# EAGLE design main (EAGLE 6.5.0)
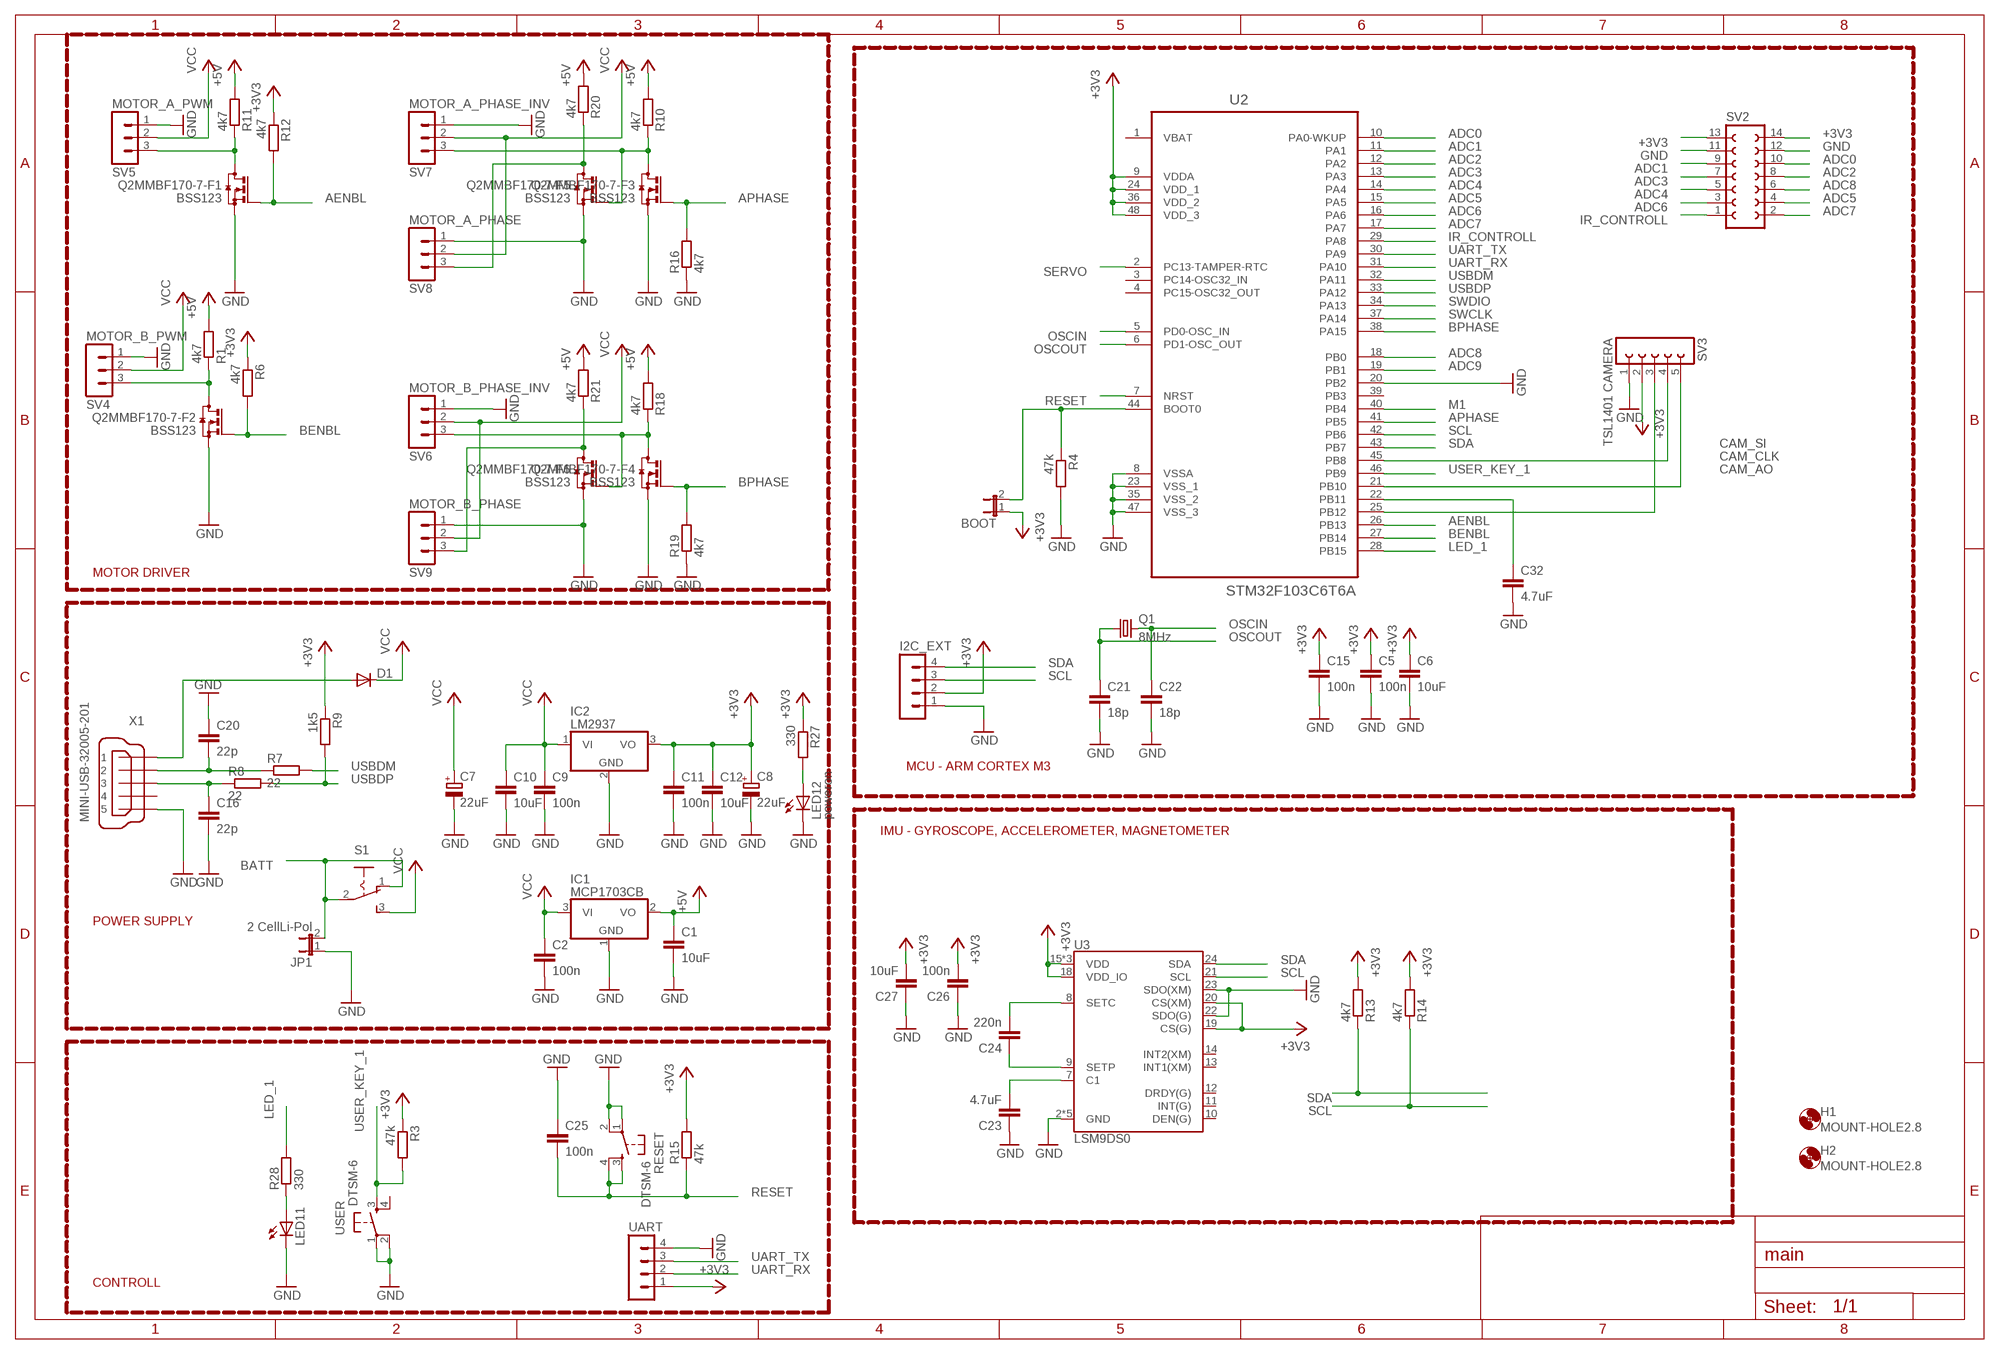
[diagram p0: schematic, sheet 1]

## Parts
BOOT  JP1E  [JP1]
C1  10uF  C-EUC0805  [C0805]
C2  100n  C-EUC0805  [C0805]
C5  100n  C-EUC0805  [C0805]
C6  10uF  C-EUC0805  [C0805]
C7  22uF  CPOL-EU153CLV-0505  [153CLV-0505]
C8  22uF  CPOL-EU153CLV-0505  [153CLV-0505]
C9  100n  C-EUC0805  [C0805]
C10  10uF  C-EUC0805  [C0805]
C11  100n  C-EUC0805  [C0805]
C12  10uF  C-EUC0805  [C0805]
C15  100n  C-EUC0805  [C0805]
C16  22p  C-EUC0805  [C0805]
C20  22p  C-EUC0805  [C0805]
C21  18p  C-EUC0805  [C0805]
C22  18p  C-EUC0805  [C0805]
C23  4.7uF  C-EUC0805  [C0805]
C24  220n  C-EUC0805  [C0805]
C25  100n  C-EUC0805  [C0805]
C26  100n  C-EUC0805  [C0805]
C27  10uF  C-EUC0805  [C0805]
C32  4.7uF  C-EUC0805  [C0805]
D1  DIODE-SMB  [SMB]
H1  MOUNT-HOLE2.8  [2,8]
H2  MOUNT-HOLE2.8  [2,8]
I2C_EXT  MA04-1  [MA04-1]
IC1  MCP1703CB  [SOT23]
IC2  LM2937  [TO263-3]
JP1  2 CellLi-Pol  JP1E  [JP1]
LED11  LEDCHIPLED_1206  [CHIPLED_1206]
LED12  poweron  LEDCHIPLED_1206  [CHIPLED_1206]
Q1  8MHz  CRYSTALCTS406  [CTS406]
Q2MMBF170-7-F1  BSS123  [SOT23]
Q2MMBF170-7-F2  BSS123  [SOT23]
Q2MMBF170-7-F3  BSS123  [SOT23]
Q2MMBF170-7-F4  BSS123  [SOT23]
Q2MMBF170-7-F5  BSS123  [SOT23]
Q2MMBF170-7-F6  BSS123  [SOT23]
R1  4k7  R-EU_M0805  [M0805]
R3  47k  R-EU_M0805  [M0805]
R4  47k  R-EU_M0805  [M0805]
R6  4k7  R-EU_M0805  [M0805]
R7  22  R-EU_M0805  [M0805]
R8  22  R-EU_M0805  [M0805]
R9  1k5  R-EU_M0805  [M0805]
R10  4k7  R-EU_M0805  [M0805]
R11  4k7  R-EU_M0805  [M0805]
R12  4k7  R-EU_M0805  [M0805]
R13  4k7  R-EU_M0805  [M0805]
R14  4k7  R-EU_M0805  [M0805]
R15  47k  R-EU_M0805  [M0805]
R16  4k7  R-EU_M0805  [M0805]
R18  4k7  R-EU_M0805  [M0805]
R19  4k7  R-EU_M0805  [M0805]
R20  4k7  R-EU_M0805  [M0805]
R21  4k7  R-EU_M0805  [M0805]
R27  330  R-EU_M0805  [M0805]
R28  330  R-EU_M0805  [M0805]
RESET  DTSM-6  [DTSM-6]
S1  255SB  [255SB]
SV2  FE07-2  [FE07-2]
SV3  TSL1401 CAMERA  FE05-1  [FE05-1]
SV4  MOTOR_B_PWM  MA03-1  [MA03-1]
SV5  MOTOR_A_PWM  MA03-1  [MA03-1]
SV6  MOTOR_B_PHASE_INV  MA03-1  [MA03-1]
SV7  MOTOR_A_PHASE_INV  MA03-1  [MA03-1]
SV8  MOTOR_A_PHASE  MA03-1  [MA03-1]
SV9  MOTOR_B_PHASE  MA03-1  [MA03-1]
U2  STM32F103C6T6A  [QFP50P900X900X160-48N]
U3  LSM9DS0  [LGA-24]
UART  MA04-1  [MA04-1]
USER  DTSM-6  [DTSM-6]
X1  MINI-USB-32005-201  [32005-201]

## Nets
+3V3: BOOT.1 C5.1 C6.1 C8.+ C11.1 C12.1 C15.1 C26.2 C27.2 I2C_EXT.2 IC2.3(VO) R3.1 R6.1 R9.1 R12.1 R13.2 R14.2 R15.2 R27.1 SV2.13 SV2.14 SV3.2 U2.9(VDDA) U2.24(VDD_1) U2.36(VDD_2) U2.48(VDD_3) U3.15(VDD) U3.16(VDD) U3.17(VDD) U3.18(VDD_IO) U3.19(CS(G)) U3.20(CS(XM)) UART.1
+5V: C1.1 IC1.2(VO) R1.2 R10.2 R11.2 R18.2 R20.2 R21.2
ADC0: SV2.10 U2.10(PA0-WKUP)
ADC1: SV2.9 U2.11(PA1)
ADC2: SV2.8 U2.12(PA2)
ADC3: SV2.7 U2.13(PA3)
ADC4: SV2.5 U2.14(PA4)
ADC5: SV2.4 U2.15(PA5)
ADC6: SV2.3 U2.16(PA6)
ADC7: SV2.2 U2.17(PA7)
ADC8: SV2.6 U2.18(PB0)
ADC9: U2.19(PB1)
AENBL: Q2MMBF170-7-F1.1(G) R12.2 U2.26(PB13)
APHASE: Q2MMBF170-7-F3.1(G) R16.2 U2.41(PB5)
BATT: JP1.2 S1.1(O) S1.2(P)
BENBL: Q2MMBF170-7-F2.1(G) R6.2 U2.27(PB14)
BPHASE: Q2MMBF170-7-F4.1(G) R19.2 U2.38(PA15)
CAM_AO: SV3.3 U2.25(PB12)
CAM_CLK: SV3.4 U2.45(PB8)
CAM_SI: SV3.5 U2.21(PB10)
GND: C1.2 C2.2 C5.2 C6.2 C7.- C8.- C9.2 C10.2 C11.2 C12.2 C15.2 C16.2 C20.1 C21.2 C22.2 C23.1 C25.1 C26.1 C27.1 C32.2 I2C_EXT.1 IC1.1(GND) IC2.2(GND) JP1.1 LED11.C LED12.C Q2MMBF170-7-F1.2(S) Q2MMBF170-7-F2.2(S) Q2MMBF170-7-F3.2(S) Q2MMBF170-7-F4.2(S) Q2MMBF170-7-F5.2(S) Q2MMBF170-7-F6.2(S) R4.2 R16.1 R19.1 RESET.1 RESET.2 SV2.11 SV2.12 SV3.1 SV4.1 SV5.1 SV6.1 SV7.1 SV8.1 SV9.1 U2.8(VSSA) U2.20(PB2) U2.23(VSS_1) U2.35(VSS_2) U2.47(VSS_3) U3.2(GND) U3.3(GND) U3.4(GND) U3.5(GND) U3.6(GND) U3.22(SDO(G)) U3.23(SDO(XM)) UART.4 USER.1 USER.2 X1.5
IR_CONTROLL: SV2.1 U2.29(PA8)
LED_1: R28.2 U2.28(PB15)
M1: U2.40(PB4)
N$1: Q2MMBF170-7-F5.3(D) R20.1 SV8.3
N$2: Q2MMBF170-7-F4.3(D) Q2MMBF170-7-F6.1(G) R18.1 SV6.3
N$3: Q2MMBF170-7-F1.3(D) R11.1 SV5.3
N$4: Q2MMBF170-7-F2.3(D) R1.1 SV4.3
N$5: Q2MMBF170-7-F3.3(D) Q2MMBF170-7-F5.1(G) R10.1 SV7.3
N$6: C23.2 U3.7(C1)
N$7: C24.2 U3.8(SETC)
N$8: Q2MMBF170-7-F6.3(D) R21.1 SV9.3
N$13: C24.1 U3.9(SETP)
N$14: C32.1 U2.22(PB11)
N$16: BOOT.2 R4.1 U2.44(BOOT0)
N$23: LED12.A R27.2
N$33: LED11.A R28.1
N$55: C20.2 R7.1 X1.2
N$56: C16.1 R8.1 X1.3
N$57: D1.A X1.1
OSCIN: C22.1 Q1.3 U2.5(PD0-OSC_IN)
OSCOUT: C21.1 Q1.1 U2.6(PD1-OSC_OUT)
RESET: C25.2 R15.1 RESET.3 RESET.4 U2.7(NRST)
SCL: I2C_EXT.3 R14.1 U2.42(PB6) U3.21(SCL)
SDA: I2C_EXT.4 R13.1 U2.43(PB7) U3.24(SDA)
SERVO: U2.2(PC13-TAMPER-RTC)
SWCLK: U2.37(PA14)
SWDIO: U2.34(PA13)
UART_RX: U2.31(PA10) UART.2
UART_TX: U2.30(PA9) UART.3
USBDM: R7.2 U2.32(PA11)
USBDP: R8.2 R9.2 U2.33(PA12)
USER_KEY_1: R3.2 U2.46(PB9) USER.3
VCC: C2.1 C7.+ C9.1 C10.1 D1.C IC1.3(VI) IC2.1(VI) S1.3(S) SV4.2 SV5.2 SV6.2 SV7.2 SV8.2 SV9.2
Unconnected: U2.3(PC14-OSC32_IN) U2.4(PC15-OSC32_OUT) U2.39(PB3) U3.10(DEN(G)) U3.11(INT(G)) U3.12(DRDY(G)) U3.13(INT1(XM)) U3.14(INT2(XM)) USER.4 X1.4

## Notes on the sheet
- MOTOR DRIVER
- MCU - ARM CORTEX M3
- IMU - GYROSCOPE, ACCELEROMETER, MAGNETOMETER
- POWER SUPPLY
- CONTROLL

## Power pins joined to a net without a drawn wire
VBAT: U2.1(VBAT)

## Library data of the parts
BOOT JP1 = jumper:JP1E: JUMPER
C1 C2 C5 C6 C9-C12 C15 C16 C20-C27 C32 = resistor:C-EU: CAPACITOR, European symbol
C7 C8 = resistor:CPOL-EU: POLARIZED CAPACITOR, European symbol
D1 = diode:DIODE-: DIODE
H1 H2 = holes:MOUNT-HOLE: MOUNTING HOLE with drill center marker
I2C_EXT UART = con-lstb:MA04-1: PIN HEADER; OC_FARNELL: unknown; OC_NEWARK: unknown
IC1 = linear:MCP1703: 250 mA, 16V, Low Quiescent Current LDO Regulator Source: http://ww1.microchip.com/downloads/en/DeviceDoc/22049b.pdf
IC2 = linear:LM2937: LM2937-2.5, LM2937-3.3 400mA and 500mA Voltage Regulators Source: http://cache.national.com/ds/LM/LM2937-2.5.pdf
LED11 LED12 = led:LED: LED OSRAM: - CHIPLED LG R971, LG N971, LY N971, LG Q971, LY Q971, LO R971, LY R971 LH N974, LH R974 LS Q976, LO Q976, LY Q976 LO Q996 - Hyper CHIPLED LW Q18S LB Q993, LB Q99A, LB R99A - SideLED LS A670, LO A670, LY A670, LG A670, LP A670 LB A673, LV A673, LT A673, LW A673 LH A674 LY A675 LS A676, LA A676, LO A676, LY A676, LW A676 LS A679, LY A679, LG A679 - Hyper Micro SIDELED® LS Y876, LA Y876, LO Y876, LY Y876 LT Y87S - SmartLED LW L88C, LW L88S LB L89C, LB L89S, LG L890 LS L89K, LO L89K, LY L89K LS L896, LA L896, LO L896, LY L896 - TOPLED LS T670, LO T670, LY T670, LG T670, LP T670 LSG T670, LSP T670, LSY T670, LOP T670, LYG T670 LG T671, LOG T671, LSG T671 LB T673, LV T673, LT T673, LW T673 LH T674 LS T676, LA T676, LO T676, LY T676, LB T676, LH T676, LSB T676, LW T676 LB T67C, LV T67C, LT T67C, LS T67K, LO T67K, LY T67K, LW E67C LS E67B, LA E67B, LO E67B, LY E67B, LB E67C, LV E67C, LT E67C LW T67C LS T679, LY T679, LG T679 LS T770, LO T770, LY T770, LG T770, LP T770 LB T773, LV T773, LT T773, LW T773 LH T774 LS E675, LA E675, LY E675, LS T675 LS T776, LA T776, LO T776, LY T776, LB T776 LHGB T686 LT T68C, LB T68C - Hyper Mini TOPLED® LB M676 - Mini TOPLED Santana® LG M470 LS M47K, LO M47K, LY M47K Source: http://www.osram.convergy.de LUXEON: - LUMILED® LXK2-PW12-R00, LXK2-PW12-S00, LXK2-PW14-U00, LXK2-PW14-V00 LXK2-PM12-R00, LXK2-PM12-S00, LXK2-PM14-U00 LXK2-PE12-Q00, LXK2-PE12-R00, LXK2-PE12-S00, LXK2-PE14-T00, LXK2-PE14-U00 LXK2-PB12-K00, LXK2-PB12-L00, LXK2-PB12-M00, LXK2-PB14-N00, LXK2-PB14-P00, LXK2-PB14-Q00 LXK2-PR12-L00, LXK2-PR12-M00, LXK2-PR14-Q00, LXK2-PR14-R00 LXK2-PD12-Q00, LXK2-PD12-R00, LXK2-PD12-S00 LXK2-PH12-R00, LXK2-PH12-S00 LXK2-PL12-P00, LXK2-PL12-Q00, LXK2-PL12-R00 Source: www.luxeon.com KINGBRIGHT: KA-3528ASYC Source: www.kingbright.com
Q1 = crystal:CRYSTAL: CRYSTAL; OC_FARNELL: unknown; OC_NEWARK: unknown
Q2MMBF170-7-F1-Q2MMBF170-7-F6 = transistor-small-signal:BSS123: N-CHANNEL MOS FET
R1 R3 R4 R6-R16 R18-R21 R27 R28 = resistor:R-EU_: RESISTOR, European symbol
RESET USER = switch-tact:DTSM-6
S1 = switch:255SB: SLIDING SWITCH Distributor Buerklin, 11G810
SV2 = con-lsta:FE07-2: FEMALE HEADER; OC_FARNELL: unknown; OC_NEWARK: unknown
SV3 = con-lsta:FE05-1: FEMALE HEADER; OC_FARNELL: unknown; OC_NEWARK: unknown
SV4-SV9 = con-lstb:MA03-1: PIN HEADER; OC_FARNELL: unknown; OC_NEWARK: unknown
U2 = stm32f103_lqfp48:STM32F103C6T6A: MCU, 32BIT, 32K FLASH, 48LQFP; MPN: STM32F103C6T6A; OC_FARNELL: 1972391; OC_NEWARK: 72T2643; PACKAGE: 48LQFP; SUPPLIER: STMicroelectronics
U3 = SparkFun-DigitalIC:LSM9DS0: LSM9DS0 3D Accelerometer, 3D Gyroscope, 3D Magnetomter Features: 3 acceleration channels, 3 angular rate channels, 3 magnetic field channels ±2/±4/±6/±8/±16 g linear acceleration full scale ±2/±4/±8/±12 gauss magnetic full scale ±245/±500/±2000 dps angular rate full scale 16-bit data output SPI / I2C serial interfaces Analog supply voltage 2.4 V to 3.6 V Power-down mode / low-power mode Programmable interrupt generators Embedded self-test Embedded temperature sensor Embedded FIFO Position and motion detection functions Click/double-click recognition
X1 = con-cypressindustries:MINI-USB-: MINI USB-B Conector Source: www.cypressindustries.com; OC_FARNELL: unknown; OC_NEWARK: unknown

## Board
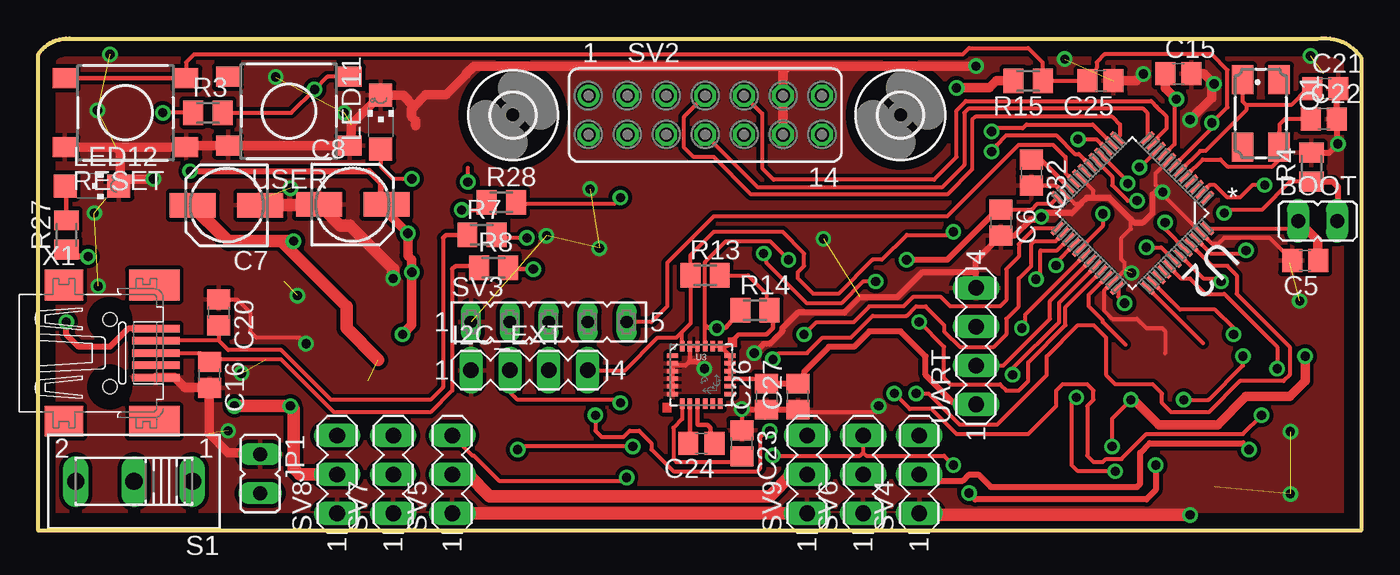
[diagram p1: board, top side]
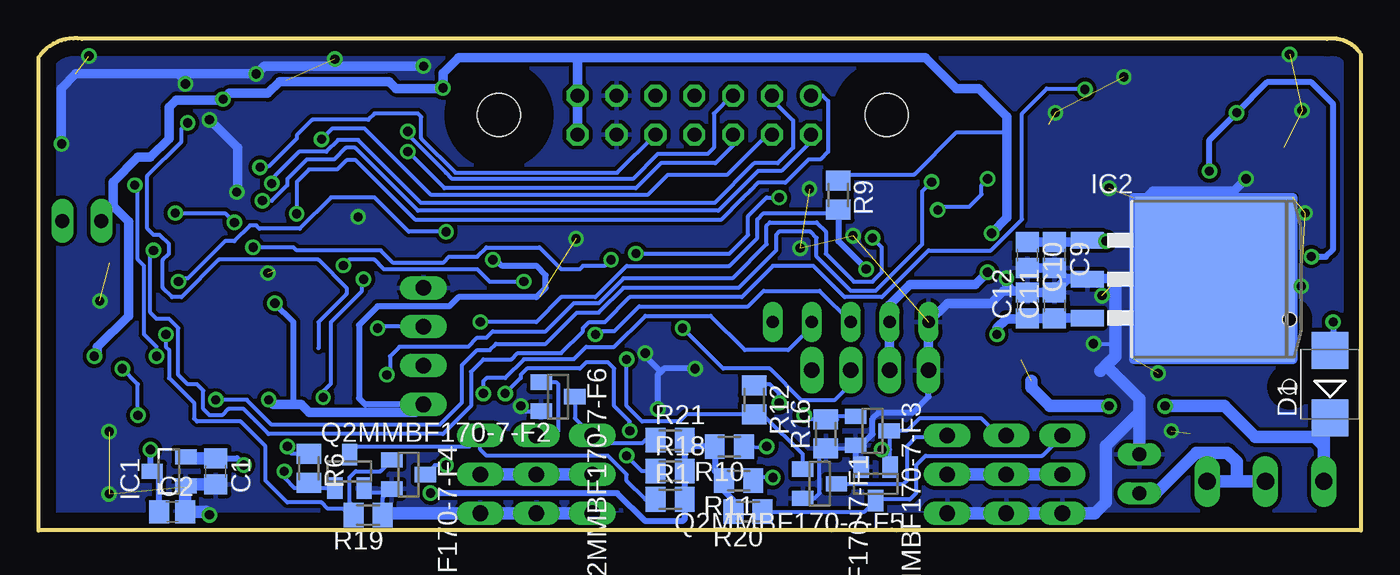
[diagram p2: board, bottom side, seen from below]

Size 86.36 x 32.14 mm. Coordinates in mm from the lower left corner, seen from the top.
Outline: 2.23,32.11 83.52,32.11 arc-66 86.36,30.89 86.36,0 0,0 0,31.09 arc-66 2.23,32.11
Copper layers (1*16): Top 0.035mm / dielectric 1.5mm / Bottom 0.035mm
Design rules "default *": minimum track width 10mil, minimum drill 24mil, track to track 10mil, track to pad 10mil, pad to pad 10mil, via to via 10mil, smd to smd 10mil, copper to edge 40mil, drill to drill 8mil, minimum pad ring 10mil, minimum via ring 8mil, stop-mask expansion 4mil, vias tented up to drill 0mil, thermal gap 10mil

### Footprints (pad centres in the part's own frame; a part is rotated, then mirrored left to right if it is on the bottom)
JP1 = drill 0.914 long: 1 0,-1.27; 2 0,1.27
C0805 = smd 1.3 x 1.5: 1 -0.85,0; 2 0.85,0
153CLV-0505 = smd 3 x 1.6: + 2.2,0; - -2.2,0
SMB = smd 2.4 x 2.4: A 2.2,0; C -2.2,0
2,8 = hole 2.8: 0,0
MA04-1 = drill 1.016 long: 1 -3.81,0; 2 -1.27,0; 3 1.27,0; 4 3.81,0
SOT23 = smd 1 x 1.4: 1 -0.95,-1.1; 2 0.95,-1.1; 3 0,1.1
TO263-3 = smd 1.067 x 2.159: 1 -2.54,-5.791; 2 0,-5.791; 3 2.54,-5.791 | smd 10.8 x 10.41: TAB 0,2.54
CHIPLED_1206 = smd 1.5 x 1.5: A 0,-1.75; C 0,1.75
CTS406 = smd 1.9 x 1.4: 1 -2.2,-1.2; 2 2.2,-1.2; 3 2.2,1.2; 4 -2.2,1.2
M0805 = smd 1.3 x 1.6: 1 -0.95,0; 2 0.95,0
DTSM-6 = smd 1.55 x 1.3: 1 -3.975,2.25; 2 3.975,2.25; 3 -3.975,-2.25; 4 3.975,-2.25
255SB = drill 1.118 long: 1 -3.81,0; 2 0,0; 3 3.81,0
FE07-2 = drill 0.914: 1 -7.62,1.27 | drill 0.914 octagon: 2 -7.62,-1.27; 3 -5.08,1.27; 4 -5.08,-1.27; 5 -2.54,1.27; 6 -2.54,-1.27; 7 0,1.27; 8 0,-1.27; 9 2.54,1.27; 10 2.54,-1.27; 11 5.08,1.27; 12 5.08,-1.27; 13 7.62,1.27; 14 7.62,-1.27
FE05-1 = drill 0.813 long: 1 -5.08,0; 2 -2.54,0; 3 0,0; 4 2.54,0; 5 5.08,0
MA03-1 = drill 1.016 long: 1 -2.54,0; 2 0,0; 3 2.54,0
QFP50P900X900X160-48N = smd 1.041 x 0.279: 1 -4.166,2.743; 2 -4.166,2.261; 3 -4.166,1.753; 4 -4.166,1.245; 5 -4.166,0.762; 6 -4.166,0.254; 7 -4.166,-0.254; 8 -4.166,-0.762; 9 -4.166,-1.245; 10 -4.166,-1.753; 11 -4.166,-2.261; 12 -4.166,-2.743; 25 4.166,-2.743; 26 4.166,-2.261; 27 4.166,-1.753; 28 4.166,-1.245; 29 4.166,-0.762; 30 4.166,-0.254; 31 4.166,0.254; 32 4.166,0.762; 33 4.166,1.245; 34 4.166,1.753; 35 4.166,2.261; 36 4.166,2.743 | smd 0.279 x 1.041: 13 -2.743,-4.166; 14 -2.261,-4.166; 15 -1.753,-4.166; 16 -1.245,-4.166; 17 -0.762,-4.166; 18 -0.254,-4.166; 19 0.254,-4.166; 20 0.762,-4.166; 21 1.245,-4.166; 22 1.753,-4.166; 23 2.261,-4.166; 24 2.743,-4.166; 37 2.743,4.166; 38 2.261,4.166; 39 1.753,4.166; 40 1.245,4.166; 41 0.762,4.166; 42 0.254,4.166; 43 -0.254,4.166; 44 -0.762,4.166; 45 -1.245,4.166; 46 -1.753,4.166; 47 -2.261,4.166; 48 -2.743,4.166
LGA-24 = smd 0.7 x 0.29: 1 -1.875,1.25; 2 -1.875,0.75; 3 -1.875,0.25; 4 -1.875,-0.25; 5 -1.875,-0.75; 6 -1.875,-1.25; 13 1.875,-1.25; 14 1.875,-0.75; 15 1.875,-0.25; 16 1.875,0.25; 17 1.875,0.75; 18 1.875,1.25 | smd 0.29 x 0.7: 7 -1.25,-1.875; 8 -0.75,-1.875; 9 -0.25,-1.875; 10 0.25,-1.875; 11 0.75,-1.875; 12 1.25,-1.875; 19 1.25,1.875; 20 0.75,1.875; 21 0.25,1.875; 22 -0.25,1.875; 23 -0.75,1.875; 24 -1.25,1.875
32005-201 = smd 3.1 x 0.5: 1 3,1.6; 2 3,0.8; 3 3,0; 4 3,-0.8; 5 3,-1.6 | smd 2.5 x 2: M1 -3,-4.45; M2 -3,4.45 | smd 3.3 x 2: M3 2.9,4.45; M4 2.9,-4.45 | hole 0.9: 0,2.2; 0,-2.2

### Placement (x,y rotation side)
BOOT  83.52,20.22 270 top
C1  74.78,3.86 270 bottom
C2  77.62,1.22 0 bottom
C5  82.7,17.63 180 top
C6  62.84,20.12 270 top
C7  12.29,21.23 180 top
C8  20.52,21.29 0 top
C9  20.02,17.98 270 bottom
C10  21.79,17.98 270 bottom
C11  20.02,14.68 90 bottom
C12  21.79,14.68 90 bottom
C15  74.42,29.82 0 top
C16  11.18,10.16 270 top
C20  11.79,14.22 270 top
C21  84.02,28.85 0 top
C22  83.92,26.87 0 top
C23  45.92,5.69 270 top
C24  43.28,5.69 180 top
C25  69.34,29.36 180 top
C26  47.55,8.74 90 top
C27  49.58,8.74 90 top
C32  64.82,23.37 270 top
D1  2.03,9.55 90 bottom
H1  30.99,27.13 0 top
H2  56.29,27.13 0 top
I2C_EXT  32.05,10.46 0 top
IC1  77.83,3.86 90 bottom
IC2  12.09,16.41 270 bottom
JP1  14.48,3.71 180 top
LED11  22.35,26.67 0 top
LED12  3.51,22.5 270 top
Q1  79.81,27.23 270 top
Q2MMBF170-7-F1  35.36,3.05 270 bottom
Q2MMBF170-7-F2  66.04,3.86 0 bottom
Q2MMBF170-7-F3  31.9,6.5 270 bottom
Q2MMBF170-7-F4  62.18,3.66 270 bottom
Q2MMBF170-7-F5  31.7,3.05 180 bottom
Q2MMBF170-7-F6  52.43,8.74 270 bottom
R1  45.11,2.03 0 bottom
R3  11.07,27.28 0 top
R4  83.11,23.72 90 top
R6  68.68,4.06 270 bottom
R7  28.96,19.3 0 top
R8  29.72,17.17 0 top
R9  34.14,21.89 270 bottom
R10  41.25,5.49 180 bottom
R11  40.64,3.25 180 bottom
R12  39.62,8.53 270 bottom
R13  43.54,16.66 0 top
R14  46.79,14.38 0 top
R15  64.62,29.36 180 top
R16  34.95,6.3 90 bottom
R18  45.11,3.86 0 bottom
R19  64.82,1.02 180 bottom
R20  40.03,1.22 180 bottom
R21  45.11,5.89 0 bottom
R27  1.83,19.3 90 top
R28  30.23,21.44 0 top
RESET  5.69,27.28 180 top
S1  6.25,3.2 180 top
SV2  43.54,27.13 0 top
SV3  33.32,13.61 0 top
SV4  57.51,3.66 90 top
SV5  27.03,3.66 90 top
SV6  53.85,3.66 90 top
SV7  23.16,3.66 90 top
SV8  19.51,3.66 90 top
SV9  50.19,3.66 90 top
U2  71.42,20.73 225 top
U3  43.28,10.16 0 top
UART  61.21,12.04 90 top
USER  16.36,27.38 180 top
X1  4.67,11.58 0 top

### Tracks (layer width: path | path; a pad name or v marks a point on that pad's centre or on a via)
+3V3  (via drill 0.6)
  Top 0.254: 1.89,18.29 R27.1 | R3.1 v8.13,27.28 | U2.36 70.5,15.84 70.5,15.25 v70.92,14.83 | U2.48 81.75,19.72 BOOT.1 82.25,20.17 | 83.52,17.66 C5.1 | U2.9 74.17,25.23 74.17,28.04 v74.3,28.17 | 47.35,13.99 R14.2 47.55,14.56 47.55,15.44 46.33,16.66 R13.2 | 66.33,21.95 U2.24 66.14,21.34 65.23,21.34 64.86,20.97 C6.1 | I2C_EXT.2 30.68,10.36 30.68,9.14 31.29,8.53 37.79,8.53 v38,8.33 | v70.1,5.49 70.1,7.32 v71.32,8.53
  Top 0.305: 22.1,21.18 22.35,20.93 22.37,20.93 C8.+ | U3.20 U3.19 | U3.19 U3.18 U3.17 U3.16 U3.15 47.43,9.91 C26.2 | U3.19 44.95,12.03 45.72,12.8 47.55,12.8 47.95,13.21 47.95,14.16 R14.2
  Top 0.406: v9.91,23.47 21.59,23.47 22.35,22.71 22.35,21.66 C8.+ | C26.2 C27.2 | 49.62,9.55 C27.2 | v3.25,17.88 2.3,17.88 R27.1 | C6.1 62.62,20.97 59.33,17.68 v56.69,17.68 | UART.1 61.11,8.33 59.74,8.33 57.91,10.16 57.91,11.38 56.29,13 54.25,13 53.24,11.99 51.61,11.99 49.99,10.36 49.99,9.99 C27.2
  Top 0.61: R15.2 62.54,29.36 62.08,28.91 v59.94,28.91 | C15.1 73.57,28.89 v74.3,28.17 | 83.52,17.66 83.52,18.95 BOOT.1 | v71.32,8.53 71.53,8.53 73.15,6.91 77.01,6.91 78.84,8.74 81.69,8.74 82.7,9.75 v82.7,11.38 | 22.35,20.93 22.61,20.93 v24.13,19.41 24.13,17.93 24.38,17.68 v24.38,16.87 24.38,13.41 v23.77,12.8
  Bottom 0.254: 51.1,29.31 51.16,29.26 | 33.73,23.25 29.17,23.25 26.42,26.01 23.32,26.01 23.11,26.21 | 69.7,8.33 69.49,8.13 | v38,8.33 38,8.94 38.61,9.55 39.56,9.55 R12.1 | R6.1 69.84,5.01 v70.1,5.49
  Bottom 0.305: 69.49,8.13 69.49,8.23
  Bottom 0.406: UART.1 65.02,8.23 65.43,8.64 65.43,13.41 64.21,14.63 59.54,14.63 58.93,15.24 53.85,15.24 53.24,15.85 53.24,16.66 53.85,17.27 56.08,17.27 56.49,17.68 v56.69,17.68 | 33.73,23.25 R9.1 | 82.14,20.32 BOOT.1 | 69.7,8.33 69.7,13.61 v70.92,14.83 | 8.08,27.23 v8.13,27.28 | v9.91,23.47 9.91,25.5 v8.13,27.28 | v3.25,17.88 2.3,17.88 R27.1 1.83,27.84 3.25,29.26 6.15,29.26 v8.13,27.28
  Bottom 0.61: v24.13,19.41 23.11,20.42 23.11,26.21 23.11,27.03 24.94,28.85 26.42,28.85 28.45,30.89 51.21,30.89 | SV2.14 SV2.13 51.16,29.26 51.16,30.84 51.21,30.89 | 81.48,21.18 81.48,22.76 79.86,24.38 79.05,24.38 77.83,25.6 77.83,27.64 77.34,28.12 74.35,28.12 v74.3,28.17 73.91,28.55 71.37,28.55 70.61,29.31 63.45,29.31 62.99,28.85 59.99,28.85 v59.94,28.91 59.94,29.87 58.93,30.89 51.21,30.89 | 81.48,21.18 82.09,20.57 82.09,20.37 BOOT.1 | v71.32,8.53 71.02,8.23 69.49,8.23 69.19,8.23 68.68,7.72 61.72,7.72 UART.1 | 81.48,21.18 80.47,20.17 80.47,14.02 82.5,11.99 82.5,11.58 v82.7,11.38 | IC2.3 19.98,13.87 C11.1 C12.1 21.81,13.82 23.16,13.82 23.77,13.21 v23.77,12.8 | v24.38,16.87 25.2,16.05 29.46,16.05 30.78,14.73 SV3.2 I2C_EXT.2
+5V  (via drill 0.6)
  Top 0.406: v72.95,4.27 72.95,2.64 72.34,2.03 61.16,2.03 v60.76,2.44
  Bottom 0.406: R20.2 40.98,1.97 41.66,2.64 41.66,3.19 R11.2 42.2,3.86 R10.2 43.75,5.49 R21.2 R18.2 | R18.2 R1.2 | R18.2 44.16,0.75 44.3,0.61 46.74,0.61 48.56,2.44 v60.76,2.44 | C1.1 73.39,4.71 v72.95,4.27
  Bottom 0.813: C1.1 76.63,4.71 IC1.2
ADC0  (via drill 0.6)
  Top 0.254: v71.88,23.72 71.94,23.72 U2.10
  Bottom 0.254: v71.88,23.72 71.83,23.77 71.32,23.77 69.49,25.6 69.49,25.81 68.48,26.82 64.82,26.82 64.41,27.23 61.57,27.23 61.37,27.03 61.37,25.6 59.13,23.37 48.56,23.37 SV2.10
ADC1
  Top 0.254: U2.11 72.77,25.38 73.66,26.26 73.66,27.03 73,27.69 72.64,28.04 60.55,28.04 59.94,27.43 59.94,24.38 58.47,22.91 48.01,22.91 47.24,23.67 47.24,27.23 SV2.9
ADC2
  Top 0.254: U2.12 72.43,27.24 72.14,27.53 60.71,27.53 60.45,27.28 60.45,23.88 58.98,22.4 46.99,22.4 SV2.8
ADC3
  Top 0.254: U2.13 70.61,25.8 70.61,26.52 70.1,27.03 61.16,27.03 60.96,26.82 60.96,23.57 59.33,21.95 46.53,21.95 44.09,24.38 42.77,24.38 42.16,24.99 42.16,27.03 SV2.7
ADC4  (via drill 0.6)
  Top 0.254: U2.14 68.83,26.52 64.52,26.52 64.26,26.26 62.43,26.26 v62.23,26.06
  Bottom 0.254: v62.23,26.06 62.23,25.86 59.84,23.47 59.74,23.37 59.33,22.96 47.55,22.96 45.92,24.59 42.67,24.59 42.27,24.99 42.27,27.23 41.1,28.4 SV2.5
ADC5  (via drill 0.6)
  Top 0.254: v67.87,25.55 69.08,25.55 U2.15
  Bottom 0.254: SV2.4 38.76,25.86 41.4,23.22 45.27,23.22 46.54,21.95 60.76,21.95 65.08,26.26 67.16,26.26 v67.87,25.55
ADC6  (via drill 0.6)
  Top 0.254: v71.12,22.66 71.12,22.79 U2.16
  Bottom 0.254: SV2.3 38.46,28.14 37.08,26.77 37.08,24.99 38.1,23.98 39.62,23.98 42.21,21.39 61.37,21.39 65.48,25.5 66.8,25.5 67.56,24.74 69.34,24.74 71.12,22.96 v71.12,22.66
ADC7  (via drill 0.6)
  Top 0.254: U2.17 70.1,23.12 70.1,22.56 71.12,21.54 v71.73,21.54
  Bottom 0.254: SV2.2 35.92,25.4 37.85,23.47 39.37,23.47 41.96,20.88 61.57,20.88 65.68,24.99 66.29,24.99 67.06,24.23 68.83,24.23 70.1,22.96 70.1,22.56 71.12,21.54 v71.73,21.54
ADC8  (via drill 0.6)
  Top 0.254: U2.18 67.92,24.59 67.67,24.59 66.45,25.81 63.2,25.81 62.54,25.15 62.54,25.04 v62.23,24.74
  Bottom 0.254: SV2.6 41,25.15 42.16,23.98 45.72,23.98 47.35,22.35 59.84,22.35 v62.23,24.74
AENBL  (via drill 0.6)
  Top 0.254: U2.26 66.4,18.9 65.02,18.9 64.82,18.69 64.82,17.27 64.01,16.46 64.01,14.63 63.2,13.82 63.2,12.8 62.38,11.99 60.15,11.99 59.13,13 59.13,13.41 57.91,14.63 57.3,14.63 56.69,14.02 54.46,14.02 53.03,12.6 51.21,12.6 50.19,11.58 48.36,11.58 v47.95,11.18
  Bottom 0.254: Q2MMBF170-7-F1.1 36.46,4.96 39.08,7.58 R12.2 44.03,7.58 44.5,7.11 46.94,7.11 47.95,8.13 v47.95,11.18
APHASE  (via drill 0.6)
  Top 0.254: U2.41 73.83,17.2 74.57,16.46 75.18,16.46 76.2,15.44 77.42,15.44 80.87,11.99 v80.87,10.57 | v36.37,7.52 36.37,6.5 36.78,6.1 38.2,6.1 38.61,6.5 39.22,6.5 40.03,5.69 40.03,5.28 41.45,3.86 46.94,3.86 47.14,4.06 47.14,6.1 47.55,6.5 v47.75,6.5 | v55.88,8.94 56.9,7.92 58.32,7.92 59.94,6.3 64.62,6.3 66.45,8.13 66.45,9.14 66.85,9.55 68.48,9.55 68.89,9.14 68.89,8.53 68.48,8.13 68.48,4.88 68.89,4.47 69.49,4.47 69.7,4.67 70.71,4.67 72.34,6.3 78.64,6.3 v79.86,7.52
  Bottom 0.254: Q2MMBF170-7-F3.1 34.75,7.45 R16.2 | R16.2 34.2,7.25 | R16.2 36.1,7.25 v36.37,7.52 | v47.75,6.5 47.75,7.11 48.77,8.13 48.77,10.57 49.17,10.97 50.6,10.97 51,10.57 54.46,10.57 54.86,10.16 54.86,9.96 v55.88,8.94 | v79.86,7.52 79.86,9.55 v80.87,10.57
BATT
  Bottom 0.813: S1.2 8.13,3.2 | 8.13,3.2 S1.1 | JP1.2 13.41,2.44 10.77,5.08 8.74,5.08 8.13,4.47 8.13,3.2
BENBL  (via drill 0.6)
  Top 0.254: v65.13,16.41 65.18,16.41 65.43,16.66 65.43,18.29 66.51,18.29 U2.27 | v67.77,8.69 67.46,8.38 67.46,4.27 67.87,3.86 v70.31,3.86
  Bottom 0.254: v65.13,16.41 65.23,16.31 65.23,15.65 67.26,13.61 67.26,9.6 67.77,9.09 v67.77,8.69 | R6.2 68.33,2.76 Q2MMBF170-7-F2.1 69.61,2.76 70.31,3.45 v70.31,3.86
BPHASE  (via drill 0.6)
  Top 0.254: v78.03,12.8 78.03,13.21 76.81,14.43 74.53,14.43 U2.38
  Bottom 0.254: v78.03,12.8 78.03,11.99 77.83,11.79 77.83,9.96 76.2,8.33 76.2,7.32 76,7.11 73.15,7.11 71.53,5.49 71.53,3.25 70.1,1.83 67.87,1.83 67.46,1.42 66.45,1.42 66.04,1.02 R19.2 65.77,1.56 66.04,1.83 66.04,3.45 65.63,3.86 64.03,3.86 Q2MMBF170-7-F4.1
CAM_AO  (via drill 0.6)
  Top 0.254: U2.25 65.03,19.72 64.01,18.69 64.01,17.88 63.2,17.07 63.2,15.04 62.79,14.63 59.54,14.63 58.93,15.24 57.1,15.24 56.49,14.63 54.25,14.63 53.24,13.61 50.8,13.61 v49.99,12.8
  Bottom 0.254: SV3.3 35.36,15.65 39.01,15.65 40.03,14.63 47.14,14.63 48.77,13 49.78,13 v49.99,12.8
CAM_CLK  (via drill 0.6)
  Top 0.254: 75.25,18.63 U2.45 76.64,17.27 77.62,17.27 78.23,16.66 78.23,15.44 81.69,11.99 81.69,10.16 81.28,9.75 78.44,9.75 76.4,7.72 73.97,7.72 73.36,8.33 73.36,8.94 72.75,9.55 70.31,9.55 69.7,10.16 69.7,12.6 68.89,13.41 67.87,13.41 65.84,11.38 65.84,10.16 62.59,6.91 60.15,6.91 58.12,8.94 v57.3,8.94
  Bottom 0.254: SV3.4 35.86,13.31 37.39,11.79 40.23,11.79 42.47,14.02 46.74,14.02 48.77,11.99 50.6,11.99 51.41,11.18 54.66,11.18 55.88,9.96 57.1,9.96 57.3,9.75 v57.3,8.94
CAM_SI
  Top 0.254: 67.6,22.82 U2.21 67.06,23.33 67.06,24.38 66.24,25.2 64.01,25.2 59.33,20.52 44.09,20.52 41.05,17.48 41.05,14.63 40.03,13.61 SV3.5
GND  (via drill 0.6)  (20 unrouted)
  Top 0.254: U2.47 | U2.8 72.95,23.33 72.95,22.56 73.15,22.35 73.15,22.2 73.28,22.07 | U2.23 66.93,22.07 67.67,21.34 68.07,21.34 | U2.35 70.08,16.23 | U2.35 70.92,17.02 70.92,17.48 70.71,17.68 70.71,19.1 71.32,19.71 71.32,20.32 | U2.35 69.6,15.7 69.6,14.33 70.1,13.82 71.73,13.82 72.34,13.21 73.36,13.21 73.56,13 73.56,11.58 | U2.47 76.65,18.69 77.01,18.69 77.42,19.1 80.38,19.1 C5.2 | 73.28,22.07 U2.47 | 73.28,22.07 73.3,22.1 v73.41,22.1 | 81.89,17.59 C5.2 | 81.69,17.46 C5.2 | 68.89,21.74 68.89,22.19 U2.20 | C20.1 12.97,15.07 13.82,14.22 13.82,13 14.22,12.6 17.07,12.6 v17.48,12.19 | v45.92,7.92 C23.1 | C27.1 49.75,7.72 54.66,7.72 54.86,7.92 v54.86,8.13
  Top 0.305: U3.6 U3.5 U3.4 U3.3 U3.2 41.55,10.77 42.27,10.77 42.53,11.04 U3.23 U3.22 | C32.2 66.44,22.52 U2.23
  Top 0.406: C21.2 84.77,28.75 C22.2 84.77,25.31 v84.84,25.25 84.26,24.67 R4.2 | UART.4 61.21,16.81 | 61.21,16.81 61.16,16.87 57.71,16.87 56.08,15.24 53.64,15.24 52.63,14.22 49.58,14.22 48.56,13.21 48.56,13 47.75,12.19 47.35,12.19 v46.74,11.58 | 73.15,22.35 72.75,21.95 72.75,20.73 72.14,20.12 71.53,20.12 71.32,20.32 69.9,21.74 68.89,21.74 68.48,21.74 68.07,21.34 67.46,20.73 65.73,20.73 v65.48,20.47 65.33,20.32 64.82,20.32 63.77,19.27 C6.2 61.21,17.64 61.21,16.81 | C27.1 C26.1 45.96,7.89 v45.92,7.92 | 42.53,11.04 43.02,11.04 v43.48,10.57
  Top 0.61: RESET.2 5.04,25.03 | 5.04,25.03 5.33,24.74 5.33,22.58 LED12.C 5.71,22.96 v7.52,22.96 | RESET.1 9.14,25.03 | 9.14,25.03 5.04,25.03 | 9.14,25.03 9.25,25.13 USER.2 USER.1 20.43,25.22 20.43,26.49 LED11.C 23.8,28.42 24.54,27.69 | 48.97,30.33 28.45,30.33 27.94,29.82 27.94,29.77 26.62,28.45 25.3,28.45 24.54,27.69 | 24.54,27.69 24.38,27.53 24.38,27.03 24.64,26.77 24.64,26.45 | C25.1 71.68,29.36 v72.14,29.82 | 48.97,30.33 48.62,29.97 SV2.11 SV2.12 | 48.97,30.33 v61.21,30.33 | 75.27,29.38 C15.2 76.1,29.82 v76.76,29.16 76.61,29.01 76.61,28.24 v75.18,26.82 | C8.- 18.32,21.1 | X1.5 8.92,9.98 9.55,9.35 11.14,9.35 | 11.14,9.35 C16.2 | 11.14,9.35 11.14,6.34 12.4,5.08 14.38,5.08 JP1.1
  Top 0.813: 14.43,5.03 JP1.1 | v23.16,16.46 23.16,17.07 20.32,19.91 19.7,19.91 C8.- 18.27,21.23 C7.- | SV9.1 SV5.1 | v75.18,1.02 57.61,1.02 SV4.1
  Top 1.27: C8.- 17.88,21.29
  Bottom 0.254: v17.48,12.19 16.05,12.19 | Q2MMBF170-7-F3.2 33.21,5.35 R16.1 35.36,4.94 35.36,2.44 35.7,2.1 Q2MMBF170-7-F1.2 | Q2MMBF170-7-F2.2 64.94,2.5 63.48,2.5 Q2MMBF170-7-F4.2 63.87,2.12 R19.1 | Q2MMBF170-7-F6.2 54.73,7.79 54.73,7.99 v54.86,8.13
  Bottom 0.406: v43.48,10.57 45.52,10.57 45.72,10.36 | 45.72,10.36 45.92,10.16 v45.92,7.92 | v46.74,11.58 46.74,11.38 45.72,10.36 | Q2MMBF170-7-F5.2 33,4.5 Q2MMBF170-7-F3.2 32.65,5.55 31.9,6.3 31.9,7.32 31.5,7.72 29.26,7.72 28.24,8.74 I2C_EXT.1
  Bottom 0.61: 77.22,29.82 v72.14,29.82 71.63,30.33 v61.21,30.33 | 77.22,29.82 83.91,29.82 C21.2 84.87,25.28 v84.84,25.25 | v75.18,26.82 73.36,24.99 73.36,22.15 v73.41,22.1 | v76.76,29.16 76.76,29.36 77.22,29.82 | IC2.2 19.29,16.41 | 19.29,16.41 C9.2 C10.2 | C11.2 C12.2 21.91,15.65 22.76,15.65 | C11.2 20.02,15.68 19.29,16.41 | 22.76,15.65 23.37,15.65 24.18,14.83 27.03,14.83 SV3.1 I2C_EXT.1 | v23.16,16.46 23.16,16.05 22.76,15.65 | C11.2 19.1,16.46 16.26,16.46 14.83,16.46 | 14.83,16.46 14.83,11.18 4.47,11.18 4.47,21.74 14.83,21.74 14.83,20.93 | 14.83,16.46 14.83,20.93 | 14.83,20.93 13.61,22.15 8.33,22.15 v7.52,22.96
  Bottom 0.813: 17.02,10.41 16.66,10.77 | 16.66,10.77 16.05,11.38 16.05,12.19 16.05,16.26 16.26,16.46 | JP1.1 14.48,7.72 | 14.48,7.72 14.48,8.59 16.66,10.77 | 14.48,7.72 16.66,5.54 16.66,1.83 17.37,1.12 SV8.1 SV7.1 SV5.1 | SV9.1 SV6.1 SV4.1 63.77,1.12 R19.1 | v75.18,1.02 75.39,1.22 C2.2 76.77,2.86 IC1.1 76.63,3.01 C1.2
  other vias: 19.96,27.28 83.06,30.99 36.02,22.3 33.17,19.25 71.37,16.81 51.26,19.05 67.01,30.78 3.66,20.73 16.46,22.35 16.92,15.34 13.26,10.26 3.91,15.95 3.86,27.43 4.67,31.09 12.4,6.5 36.63,18.44 15.49,29.62 81.74,6.45 81.74,2.39 82.35,14.99
  pour Top: -1.63,35.15 87.99,35.15 87.99,-8.13 -1.63,-8.13
  pour Bottom: -1.42,33.93 86.77,33.93 86.77,-6.5 -1.42,-6.5
IR_CONTROLL  (via drill 0.6)
  Top 0.254: v69.49,20.68 69.49,19.87 U2.29
  Bottom 0.254: SV2.1 35.15,28.4 34.8,28.04 34.8,24.74 35.31,24.23 36.07,24.23 37.59,22.71 39.37,22.71 39.88,22.2 40.39,21.69 41.76,20.32 61.77,20.32 65.63,24.18 66.24,24.18 66.85,23.57 68.68,23.57 69.49,22.76 v69.49,20.68
LED_1  (via drill 0.6)
  Top 0.254: 67.6,18.63 U2.28 66.45,17.51 v66.45,17.3 | v54.66,16.26 53.85,16.26 52.43,14.83 50.19,14.83 47.55,17.48 47.55,17.88 v47.35,18.08 | 31.28,21.74 R28.2 31.28,21.34 37.59,21.34 v38,21.74
  Bottom 0.254: v66.45,17.3 66.07,17.68 64.41,17.68 63.8,17.07 57.71,17.07 56.9,16.26 v54.66,16.26 | v47.35,18.08 41.25,18.08 40.03,19.3 40.03,20.52 38.81,21.74 v38,21.74
N$1
  Bottom 0.254: SV8.3 20.83,4.88 28.45,4.88 29.06,4.27 29.06,2.44 29.46,2.03 31.61,2.03 Q2MMBF170-7-F5.3 32.43,1.22 R20.1
N$2  (via drill 0.6)
  Top 0.254: v47.95,4.88 53.64,4.88 53.85,5.08 | SV6.3 53.85,5.08 | 53.85,5.08 54.05,4.88 59.13,4.88 v59.74,4.27
  Bottom 0.254: R18.1 46.94,3.86 v47.95,4.88 | Q2MMBF170-7-F6.1 52.56,9.69 52.43,9.55 52.43,6.5 52.83,6.1 53.75,6.1 SV6.3 | v59.74,4.27 60.47,4.27 Q2MMBF170-7-F4.3
N$3  (via drill 0.6)
  Top 0.254: SV5.3 28.35,4.88 28.45,4.88 30.07,3.25 38.2,3.25 v38.41,3.45
  Bottom 0.254: SV5.3 27.13,6.1 29.06,6.1 29.67,5.49 29.67,3.25 29.87,3.05 Q2MMBF170-7-F1.3 | v38.41,3.45 39.49,3.45 R11.1
N$4
  Bottom 0.254: R1.1 46.74,2.03 47.95,3.25 47.95,3.66 49.17,4.88 57.1,4.88 57.51,5.28 SV4.3 58.22,5.49 65.51,5.49 Q2MMBF170-7-F2.3 65.75,4.55
N$5  (via drill 0.6)
  Top 0.254: v38.81,5.49 31.5,5.49 v31.29,5.28
  Bottom 0.254: SV7.3 23.67,6.2 24.79,7.32 28.85,7.32 29.67,6.5 Q2MMBF170-7-F3.3 | Q2MMBF170-7-F5.1 30.75,5.28 | 30.75,5.28 30.75,6.45 Q2MMBF170-7-F3.3 | 30.6,6.71 Q2MMBF170-7-F3.3 | R10.1 38.88,5.42 v38.81,5.49 | v31.29,5.28 30.75,5.28
N$6
  Top 0.254: 42.03,8.1 42.03,7.28 41.45,6.71 41.45,4.67 41.66,4.47 45.55,4.47 C23.2
  Top 0.305: U3.7 42.03,8.1
N$7
  Top 0.305: U3.8 42.53,5.79 C24.2
N$8
  Bottom 0.254: Q2MMBF170-7-F6.3 51.33,7.33 SV9.3 49.68,5.69 46.94,5.69 46.74,5.89 R21.1
N$13
  Top 0.305: U3.9 43.03,6.96 43.08,6.91 43.69,6.91 43.89,6.71 43.89,5.93 C24.1
N$14
  Top 0.305: C32.1 65.45,24.22 U2.22
N$16  (via drill 0.6)
  Top 0.254: R4.1 81.7,22.77 79.86,20.93 77.62,20.93 v77.42,20.73 | v73.56,20.12 73.56,19.67 U2.44 | 84.84,20.47 84.84,20.27 BOOT.2
  Top 0.406: R4.1 84.52,22.77 84.84,22.45 84.84,20.47
  Bottom 0.254: v77.42,20.73 74.17,20.73 v73.56,20.12
N$23
  Top 0.305: R27.2 1.83,22.43 LED12.A
N$33  (via drill 0.6)
  Top 0.254: LED11.A 22.35,23.77 23.16,22.96 v24.38,22.96 | v27.63,20.93 28.77,20.93 R28.1
  Bottom 0.254: v24.38,22.96 24.79,22.56 24.79,21.95 25.6,21.13 27.43,21.13 v27.63,20.93
N$55
  Top 0.254: 26.42,19.1 26.42,9.35 25.6,8.53 19.1,8.53 15.85,11.79 12.4,11.79 11.79,12.4 | 11.79,12.4 X1.2 | C20.2 11.79,12.4
  Top 0.305: 26.42,19.1 26.62,19.3 R7.1
N$56
  Top 0.254: X1.3 10.6,11.58 C16.1 11.34,11.18 15.85,11.18 19.3,7.72 25.6,7.72 27.03,9.14 27.03,17.07
  Top 0.305: 27.03,17.07 27.23,17.27 28.67,17.27 R8.1
N$57  (via drill 0.6)
  Top 0.406: X1.1 5.87,13.18 4.67,11.99 2.64,11.99 1.83,12.8 v1.83,13.61
  Bottom 0.406: v1.83,13.61 1.83,11.95 D1.A
OSCIN
  Top 0.254: C22.1 81.38,26.87 81.03,26.52 81.03,25.05 Q1.3 | Q1.3 81.01,26.03 | Q1.3 81.01,24.21 80.57,23.77 77.62,23.77 77.17,24.23 76.01,24.23 U2.5
OSCOUT
  Top 0.254: C21.1 82.86,28.85 81.79,27.79 78.84,27.79 | Q1.1 78.61,28.03 78.84,27.79 | 78.84,27.79 78.84,27.44 76.2,24.79 75.85,24.79 U2.6
RESET  (via drill 0.6)
  Top 0.254: 65.62,29.82 R15.1 | 8.35,29.53 RESET.3 9.65,29.54 9.65,30.58 10.16,31.09 60.35,31.09 60.76,31.5 64.62,31.5 65.57,30.55 R15.1 | 68.77,29.76 69.09,30.21 69.09,30.58 69.6,31.09 76.61,31.09 77.62,30.07 77.62,27.64 v76.61,26.62 76.61,26.27 U2.7 | 68.77,29.76 C25.2 | R15.1 68.37,29.36 68.77,29.76
  Top 0.305: RESET.4 RESET.3
  Bottom 0.254: v76.61,26.62 77.01,26.21 77.01,25.4 79.25,23.16 79.25,19.71 78.84,19.3 78.44,19.3 77.83,18.69 77.83,18.08 78.23,17.68 78.23,15.85 77.62,15.24 77.01,15.24 74.57,17.68 68.07,17.68 66.24,15.85 66.24,15.44 68.07,13.61 68.07,11.89
SCL  (via drill 0.6)
  Top 0.254: 73.5,18.29 U2.42 73.3,18.49 v72.34,18.49 | U3.21 43.53,13.41 43.53,17.52 44.91,18.9 47.75,18.9 v48.97,17.68
  Top 0.305: R14.1 44.87,13.21 v44.3,13.21 43.73,13.21 43.53,13.41
  Bottom 0.254: v72.34,18.49 69.7,18.49 69.49,18.29 64.01,18.29 63.2,17.48 59.94,17.48 59.54,17.88 57.71,17.88 57.1,18.49 53.64,18.49 52.22,17.07 51,17.07 50.8,17.27 49.38,17.27 v48.97,17.68 | v44.3,13.21 41.66,10.57 38.61,10.57 36.58,8.53 34.34,8.53 33.53,9.35 33.53,10.26 I2C_EXT.3
SDA  (via drill 0.6)
  Top 0.254: v59.74,19.51 59.54,19.3 56.69,19.3 55.07,17.68 54.46,17.68 52.22,15.44 50.6,15.44 49.58,16.46 49.58,16.87 49.99,17.27 49.99,18.08 48.56,19.51 44.09,19.51 42.59,18 R13.1 42.59,13.53 42.03,12.97 | U2.43 76.05,16.46 77.01,16.46 v77.22,16.26 | U3.24 42.03,12.97 | 42.03,12.97 41.66,12.6 40.44,12.6 38.3,10.46 I2C_EXT.4
  Bottom 0.254: v59.74,19.51 62.18,19.51 64.41,21.74 67.26,21.74 69.29,19.71 71.93,19.71 72.14,19.91 72.54,19.91 73.56,18.9 74.17,18.9 76.61,16.46 77.01,16.46 v77.22,16.26
SERVO  (via drill 0.6)
  Top 0.254: v74.78,8.53 76.4,8.53 78.64,10.77 v78.64,11.38 | v80.06,22.56 79.25,22.56 78.44,21.74 77.62,21.74 76.81,22.56 76.45,22.56 U2.2 | v28.04,22.76 28.04,23.69
  Bottom 0.254: v78.64,11.38 78.64,11.99 79.45,12.8 79.45,17.27 79.86,17.68 79.86,22.35 v80.06,22.56 | v74.78,8.53 72.75,8.53 71.12,6.91 60.15,6.91 58.73,8.33 58.73,10.77 57.71,11.79 56.9,11.79 56.49,12.19 53.24,12.19 51.21,14.22 49.78,14.22 48.16,15.85 40.64,15.85 38.2,18.29 38.2,19.3 38,19.51 35.97,19.51 35.56,19.1 35.56,17.88 33.32,15.65 31.7,15.65 28.65,18.69 28.65,22.15 v28.04,22.76
SWCLK
  Top 0.254: 76.05,12.22 U2.37
SWDIO
  Top 0.254: U2.34 68.58,15.4 68.58,14.63 69.49,13.72 69.49,13.61 70.97,12.14
UART_RX
  Top 0.254: U2.31 66.04,14.98 66.04,13.82 62.99,10.77 UART.2
UART_TX  (via drill 0.6)
  Top 0.254: U2.30 64.41,14.08 64.41,13.41 v64.21,13.21
  Bottom 0.254: UART.3 64.11,13.31 v64.21,13.21
USBDM  (via drill 0.6)
  Top 0.254: U2.32 66.65,14.87 66.65,13.61 63.6,10.57 v63.6,10.16 | v31.9,19.1 30.11,19.1 R7.2
  Bottom 0.254: v31.9,19.1 31.29,18.49 31.29,16.87 31.9,16.26 33.12,16.26 34.95,18.08 34.95,19.51 35.56,20.12 38.61,20.12 38.81,19.91 38.81,18.69 41.05,16.46 48.16,16.46 49.78,14.83 51.41,14.83 53.24,13 56.69,13 57.1,12.6 57.71,12.6 58.32,11.99 62.79,11.99 63.4,11.38 63.4,10.36 v63.6,10.16
USBDP  (via drill 0.6)
  Top 0.254: U2.33 67.06,14.6 67.06,13.41 64.62,10.97 64.62,9.75 64.01,9.14 63.2,9.14 62.79,9.55 59.54,9.55 59.13,9.96 59.13,11.99 v57.51,13.61
  Top 0.305: v32.31,17.07 30.77,17.07 R8.2
  Bottom 0.254: R9.2 34.36,20.73 39.01,20.73 39.42,20.32 39.42,19.1 41.25,17.27 47.95,17.27 49.99,15.24 52.22,15.24 53.85,13.61 v57.51,13.61
  Bottom 0.305: 32.32,17.08 v32.31,17.07
  Bottom 0.406: R9.2 34.14,18.9 v32.31,17.07
USER_KEY_1  (via drill 0.6)
  Top 0.254: USER.3 18.86,29.63 v18.03,28.8 16.51,27.28 R3.2 | U2.46 76.55,18.08 78.64,18.08 v78.84,18.29
  Top 0.305: 20.27,29.57 USER.3
  Bottom 0.254: v78.84,18.29 79.05,18.08 79.05,14.22 78.64,13.82 77.83,13.82 77.22,13.21 77.22,10.16 76.61,9.55 76,9.55 75.59,9.14 75.59,7.92 75.18,7.52 74.37,7.52 73.97,7.92 72.95,7.92 71.32,6.3 59.94,6.3 58.12,8.13 58.12,10.36 57.3,11.18 55.47,11.18 55.07,11.58 52.22,11.58 50.8,13 50.8,13.21 50.39,13.61 49.38,13.61 47.75,15.24 40.44,15.24 38.41,17.27 35.76,17.27 33.73,15.24 31.29,15.24 28.24,18.29 24.18,18.29 22.15,20.32 22.15,27.23 20.52,28.85 18.09,28.85 v18.03,28.8
VCC  (via drill 0.6)  (1 unrouted)
  Top 0.406: SV4.2 58.32,3.66 58.73,3.25 60.35,3.25 60.76,3.66 61.37,3.66 62.18,2.84 71.73,2.84 71.93,3.05 71.93,5.08 72.54,5.69 78.64,5.69 v79.05,5.28
  Top 0.61: C7.+ 10.09,21 11.99,19.1
  Top 0.813: v16.66,18.9 15.85,18.9 | 15.85,18.9 12.43,18.9 C7.+ | 22.2,11.13 20.12,13.21 20.12,14.63 15.85,18.9 | v12.8,8.13 v16.46,8.13 16.66,7.92 16.66,4.06 17.07,3.66 SV8.2 | SV9.2 49.17,3.66 47.75,2.24 29.46,2.24 28.04,3.66 SV5.2
  Bottom 0.406: C2.1 78.47,3.41 IC1.3 79.05,3.98 v79.05,5.28
  Bottom 0.61: C10.1 C9.1 18,18.83 IC2.1
  Bottom 0.813: S1.3 2.44,5.49 | 2.44,5.49 2.44,6.94 D1.C | IC2.1 16.71,18.95 v16.66,18.9 | v12.8,8.13 8.94,8.13 6.91,6.1 3.05,6.1 2.44,5.49 | v16.46,8.13 20.32,8.13 21.54,9.35 21.54,9.75 | SV8.2 SV7.2 SV5.2 | SV9.2 SV6.2 SV4.2
(copper drawn outside any net)
  shapes: Top area x2